# EAGLE design rgb-secamfm500 (EAGLE 6.4)
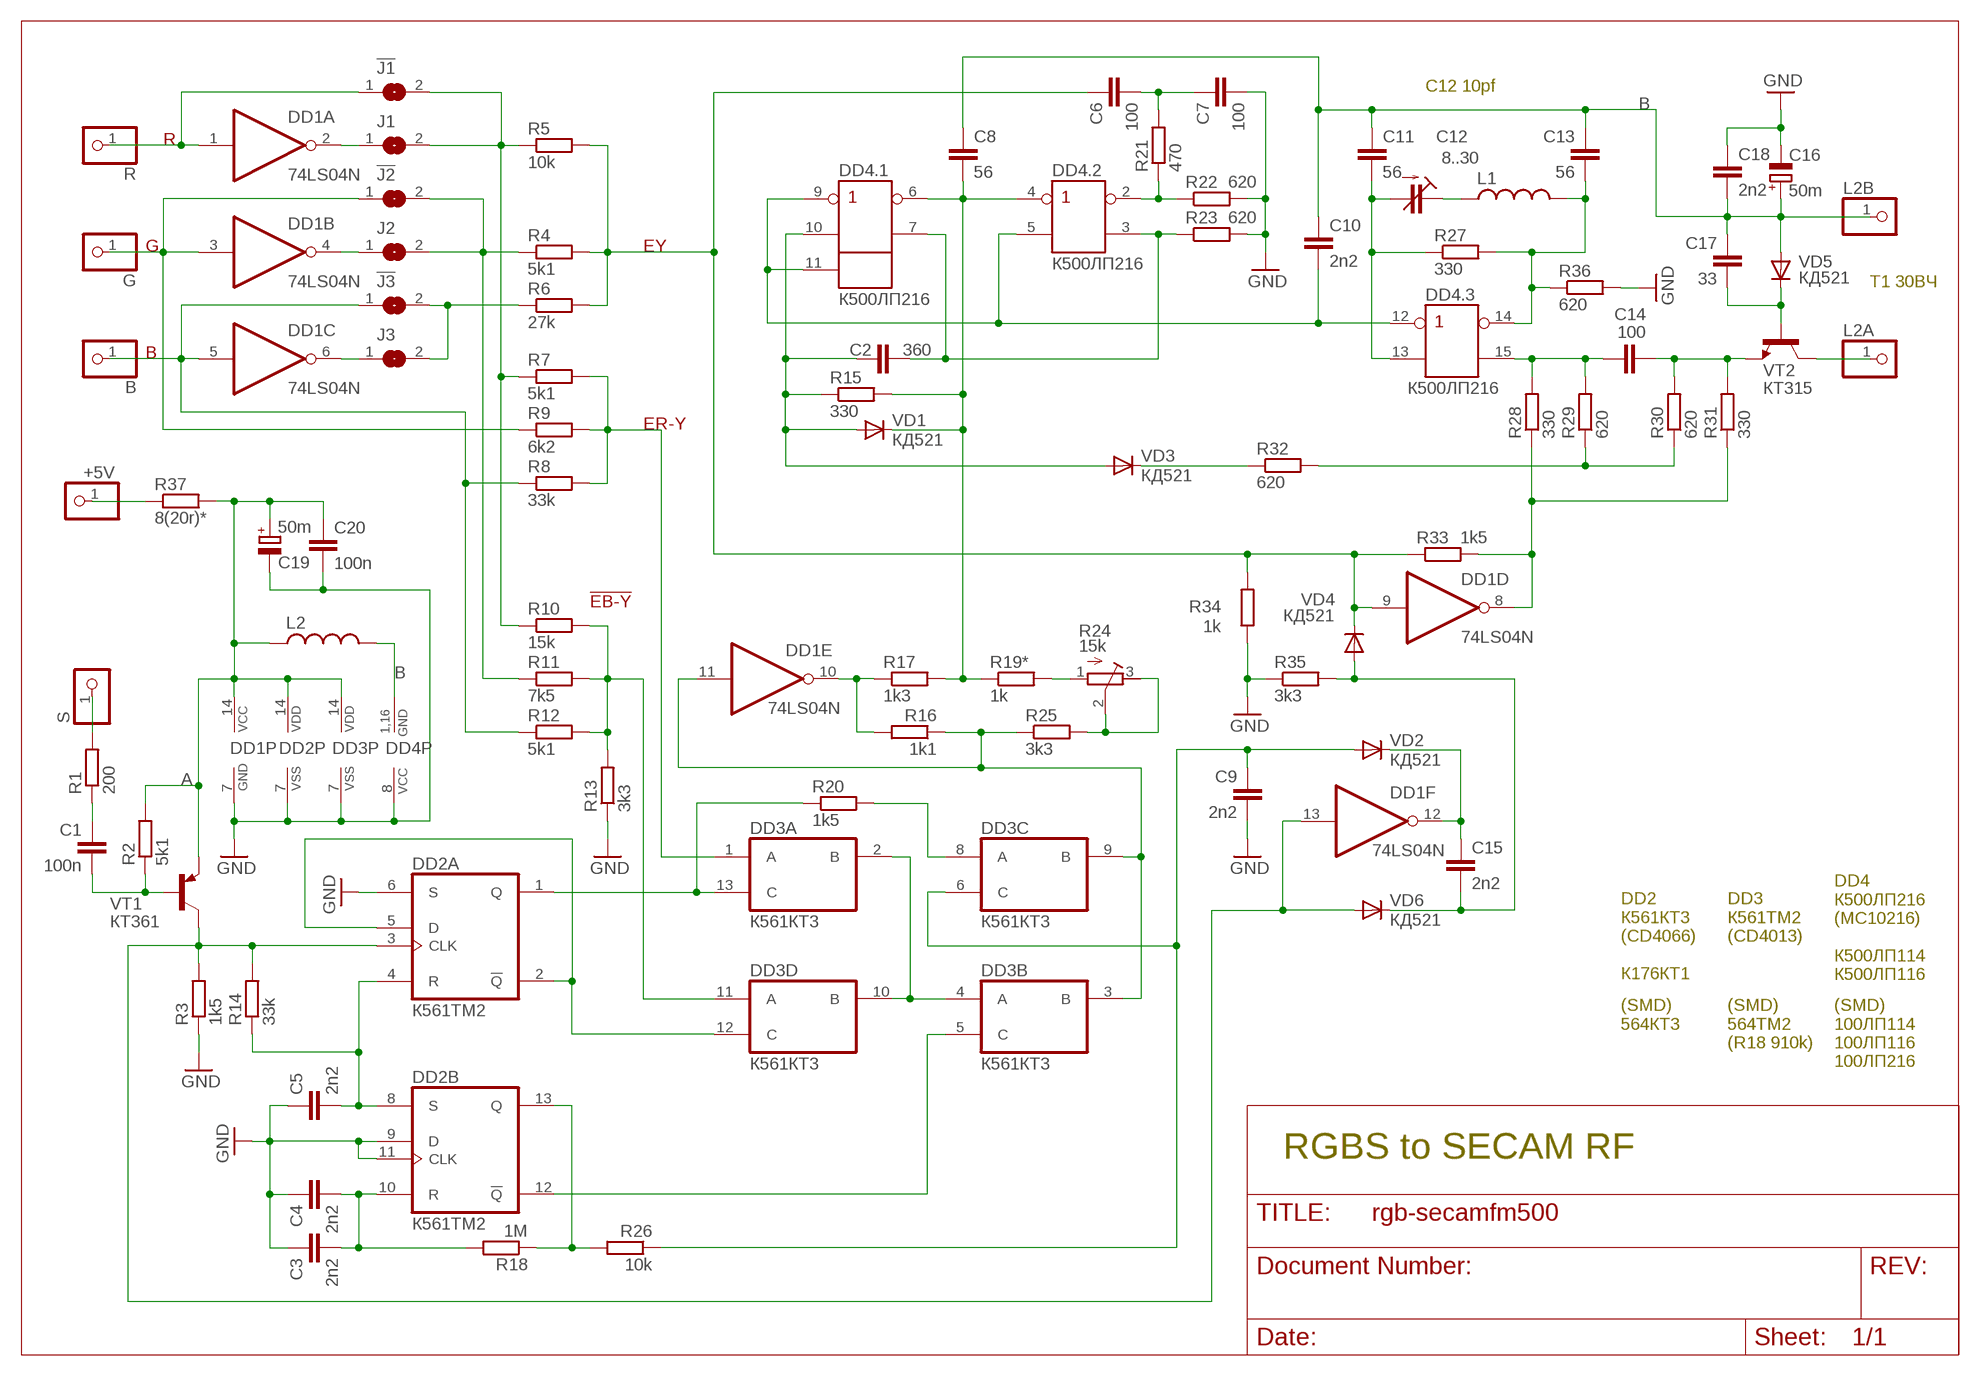
[diagram p0: schematic, sheet 1]

## Parts
!J1  SJ  [SJ]
!J2  SJ  [SJ]
!J3  SJ  [SJ]
+5V  PINHD-1X1  [1X01]
B  PINHD-1X1  [1X01]
C1  100n  C-EU025-025X050  [C025-025X050]
C2  360  C-EUC0805K  [C0805K]
C3  2n2  C-EUC0805  [C0805]
C4  2n2  C-EUC0805  [C0805]
C5  2n2  C-EUC0805K  [C0805K]
C6  100  C-EUC0805K  [C0805K]
C7  100  C-EUC0805K  [C0805K]
C8  56  C-EUC0805K  [C0805K]
C9  2n2  C-EUC0805K  [C0805K]
C10  2n2  C-EUC0805K  [C0805K]
C11  56  C-EUC0805K  [C0805K]
C12  8..30  C-TRIMM808-1  [CTRIM808-1]
C13  56  C-EUC0805K  [C0805K]
C14  100  C-EUC0805K  [C0805K]
C15  2n2  C-EUC0805K  [C0805K]
C16  50m  CPOL-EUE2.5-6  [E2,5-6]
C17  33  C-EUC0805K  [C0805K]
C18  2n2  C-EUC0805K  [C0805K]
C19  50m  CPOL-EUE2.5-6  [E2,5-6]
C20  100n  C-EUC0805K  [C0805K]
DD1  74LS04N  [DIL14]
DD2  К561ТМ2  4013N  [DIL14]
DD3  К561КТ3  4066N  [DIL14]
DD4  К500ЛП216  К500ЛП216R  [DIL16B]
G  PINHD-1X1  [1X01]
J1  SJ  [SJ]
J2  SJ  [SJ]
J3  SJ  [SJ]
L1  L1  [L1]
L2  L-US0204/5  [0204/5]
L2A  PINHD-1X1  [1X01]
L2B  PINHD-1X1  [1X01]
R  PINHD-1X1  [1X01]
R1  200  R-EU_M0805  [M0805]
R2  5k1  R-EU_M0805  [M0805]
R3  1k5  R-EU_M0805  [M0805]
R4  5k1  R-EU_M0805  [M0805]
R5  10k  R-EU_M0805  [M0805]
R6  27k  R-EU_M0805  [M0805]
R7  5k1  R-EU_M0805  [M0805]
R8  33k  R-EU_M0805  [M0805]
R9  6k2  R-EU_M0805  [M0805]
R10  15k  R-EU_M0805  [M0805]
R11  7k5  R-EU_M0805  [M0805]
R12  5k1  R-EU_M0805  [M0805]
R13  3k3  R-EU_M0805  [M0805]
R14  33k  R-EU_M0805  [M0805]
R15  330  R-EU_0207/12  [0207/12]
R16  1k1  R-EU_M0805  [M0805]
R17  1k3  R-EU_M0805  [M0805]
R18  1M  R-EU_M0805  [M0805]
R19*  1k  R-EU_M0805  [M0805]
R20  1k5  R-EU_0207/12  [0207/12]
R21  470  R-EU_M0805  [M0805]
R22  620  R-EU_M0805  [M0805]
R23  620  R-EU_M0805  [M0805]
R24  15k  R-TRIMM3296W  [RTRIM3296W]
R25  3k3  R-EU_M0805  [M0805]
R26  10k  R-EU_M0805  [M0805]
R27  330  R-EU_M0805  [M0805]
R28  330  R-EU_M0805  [M0805]
R29  620  R-EU_M0805  [M0805]
R30  620  R-EU_M0805  [M0805]
R31  330  R-EU_M0805  [M0805]
R32  620  R-EU_M0805  [M0805]
R33  1k5  R-EU_M0805  [M0805]
R34  1k  R-EU_M0805  [M0805]
R35  3k3  R-EU_M0805  [M0805]
R36  620  R-EU_M0805  [M0805]
R37  8(20r)*  R-EU_R1210  [R1210]
S  PINHD-1X1  [1X01]
VD1  КД521  DIODE-D-7.5  [D-7.5]
VD2  КД521  DIODE-D-7.5  [D-7.5]
VD3  КД521  DIODE-D-7.5  [D-7.5]
VD4  КД521  DIODE-D-7.5  [D-7.5]
VD5  КД521  DIODE-D-7.5  [D-7.5]
VD6  КД521  DIODE-D-7.5  [D-7.5]
VT1  КТ361  BJT_PNP_TO-92_ECB  [TO92]
VT2  КТ315  BJT_NPN_TO-92_ECB  [TO92]

## Nets
A: C19.+ C20.1 DD1.14(P:VCC) DD2.14(P:VDD) DD3.14(P:VDD) L2.1 R2.2 R37.2 VT1.1(E)
B: C8.1 C10.1 C11.1 C13.1 C16.+ C17.1 C18.2 DD4.1(P:GND) DD4.16(P:GND) L2.2 L2B.1 VD5.A
GND: C3.1 C4.1 C5.1 C7.2 C9.2 C16.- C18.1 C19.- C20.2 DD1.7(P:GND) DD2.6(A:S) DD2.7(P:VSS) DD2.9(B:D) DD2.11(B:CLK) DD3.7(P:VSS) DD4.8(P:VCC) R3.1 R13.1 R22.2 R23.2 R34.1 R35.1 R36.2
N$1: DD2.13(B:Q) R18.1 R26.2
N$2: R32.1 VD3.C
N$54: C6.1 DD1.9(D:I) R4.2 R5.2 R6.2 R33.1 R34.2 VD4.C
N$55: DD3.1(A:A) R7.2 R8.2 R9.2
N$56: DD3.11(D:A) R10.2 R11.2 R12.2 R13.2
N$57: !J1.1 DD1.1(A:I) R.1
N$58: !J1.2 J1.2 R5.1 R7.1 R10.1
N$59: !J2.2 J2.2 R4.1 R11.1
N$60: !J2.1 DD1.3(B:I) G.1 R9.1
N$61: DD1.6(C:O) J3.1
N$62: !J3.1 B.1 DD1.5(C:I) R8.1 R12.1
N$63: DD1.2(A:O) J1.1
N$64: DD3.2(A:B) DD3.4(B:A) DD3.10(D:B)
N$65: DD1.11(E:I) DD3.3(B:B) DD3.9(C:B) R16.1 R25.1
N$66: DD1.4(B:O) J2.1
N$67: !J3.2 J3.2 R6.1
N$68: DD2.2(A:!Q) DD2.5(A:D) DD3.12(D:C)
N$69: C5.2 DD2.4(A:R) DD2.8(B:S) R14.1
N$70: DD1.13(F:I) DD2.3(A:CLK) R3.2 R14.2 VD6.A VT1.2(C)
N$71: DD2.1(A:Q) DD3.13(A:C) R20.1
N$73: C1.2 R2.1 VT1.3(B)
N$74: R1.2 S.1
N$75: C1.1 R1.1
N$76: +5V.1 R37.1
N$77: C3.2 C4.2 DD2.10(B:R) R18.2
N$78: DD2.12(B:!Q) DD3.5(B:C)
N$79: DD1.10(E:O) R16.2 R17.1
N$80: C8.2 DD4.4(.2:!IN) DD4.6(.1:!OUT) R15.2 R17.2 R19*.1 VD1.C
N$81: C9.1 DD3.6(C:C) R26.1 VD2.A
N$82: DD3.8(C:A) R20.2
N$83: C15.1 DD1.12(F:O) VD2.C
N$84: R24.2(S) R24.3(E) R25.2
N$85: C10.2 DD4.5(.2:IN) DD4.9(.1:!IN) DD4.11(.1:V) DD4.12(.3:!IN)
N$86: C11.2 C12.2(A) DD4.13(.3:IN) R27.1
N$87: R19*.2 R24.1(A)
N$88: C2.2 DD4.3(.2:OUT) DD4.7(.1:OUT) R23.1
N$89: C2.1 DD4.10(.1:IN) R15.1 VD1.A VD3.A
N$90: DD4.2(.2:!OUT) R21.1 R22.1
N$91: C6.2 C7.1 R21.2
N$92: C13.2 DD4.14(.3:!OUT) L1.P$2 R27.2 R36.1
N$93: C12.1(E) L1.P$1
N$94: C17.2 VD5.C VT2.3(B)
N$95: C14.1 DD4.15(.3:OUT) R28.2 R29.2
N$96: C14.2 R30.2 R31.2 VT2.1(E)
N$97: R29.1 R30.1 R32.2
N$98: DD1.8(D:O) R28.1 R31.1 R33.2
N$100: L2A.1 VT2.2(C)
N$102: C15.2 R35.2 VD4.A VD6.C

## Notes on the sheet
- C12 10pf
- R
- G | EY
- T1 30ВЧ
- B
- ER-Y
- !EB-Y
- DD4 
  К500ЛП216
  (MC10216)
  
  К500ЛП114
  К500ЛП116
- DD2
  К561КТ3
  (CD4066)
  
  К176КТ1
- DD3
  К561ТМ2
  (CD4013)
- (SMD)
  564КТ3
- (SMD)
  564ТМ2
  (R18 910k)
- (SMD)
  100ЛП114
  100ЛП116
  100ЛП216
- RGBS to SECAM RF

## Library data of the parts
!J1-!J3 J1-J3 = jumper:SJ: SMD solder JUMPER
+5V B G L2A L2B R S = Разъёмы штырьковые 2.54мм:PINHD-1X1: PIN HEADER
C1-C11 C13-C15 C17 C18 C20 = rcl:C-EU: CAPACITOR, European symbol
C12 = Speccy:C-TRIMM: Trimm capacitor
C16 C19 = rcl:CPOL-EU: POLARIZED CAPACITOR, European symbol
DD1 = 74xx-eu:74*04: Hex INVERTER
DD2 = 40xx:4013: Dual D FLIP FLOP, set/reset
DD3 = 40xx:4066: Quad bilateral ANALOG SWITCH
DD4 = 500:К500ЛП
L1 = secam500lp:L1
L2 = rcl:L-US: INDUCTOR, American symbol
R1-R18 R19* R20-R23 R25-R37 = rcl:R-EU_: RESISTOR, European symbol
R24 = rcl:R-TRIMM: Trimm resistor
VD1-VD6 = diode:DIODE-: DIODE
VT1 = m_transistor:BJT_PNP: PNP Transistror КТ3107* CBE BD138 ECB BC847 SOT23 BCE
VT2 = m_transistor:BJT_NPN: NPN Transistor 13005 TO-220 BCE КТ805 TO-220 ECB КТ3102*М TO-92 CBE МП37 ТО-5 BC847 SOT23 BCE

## Board
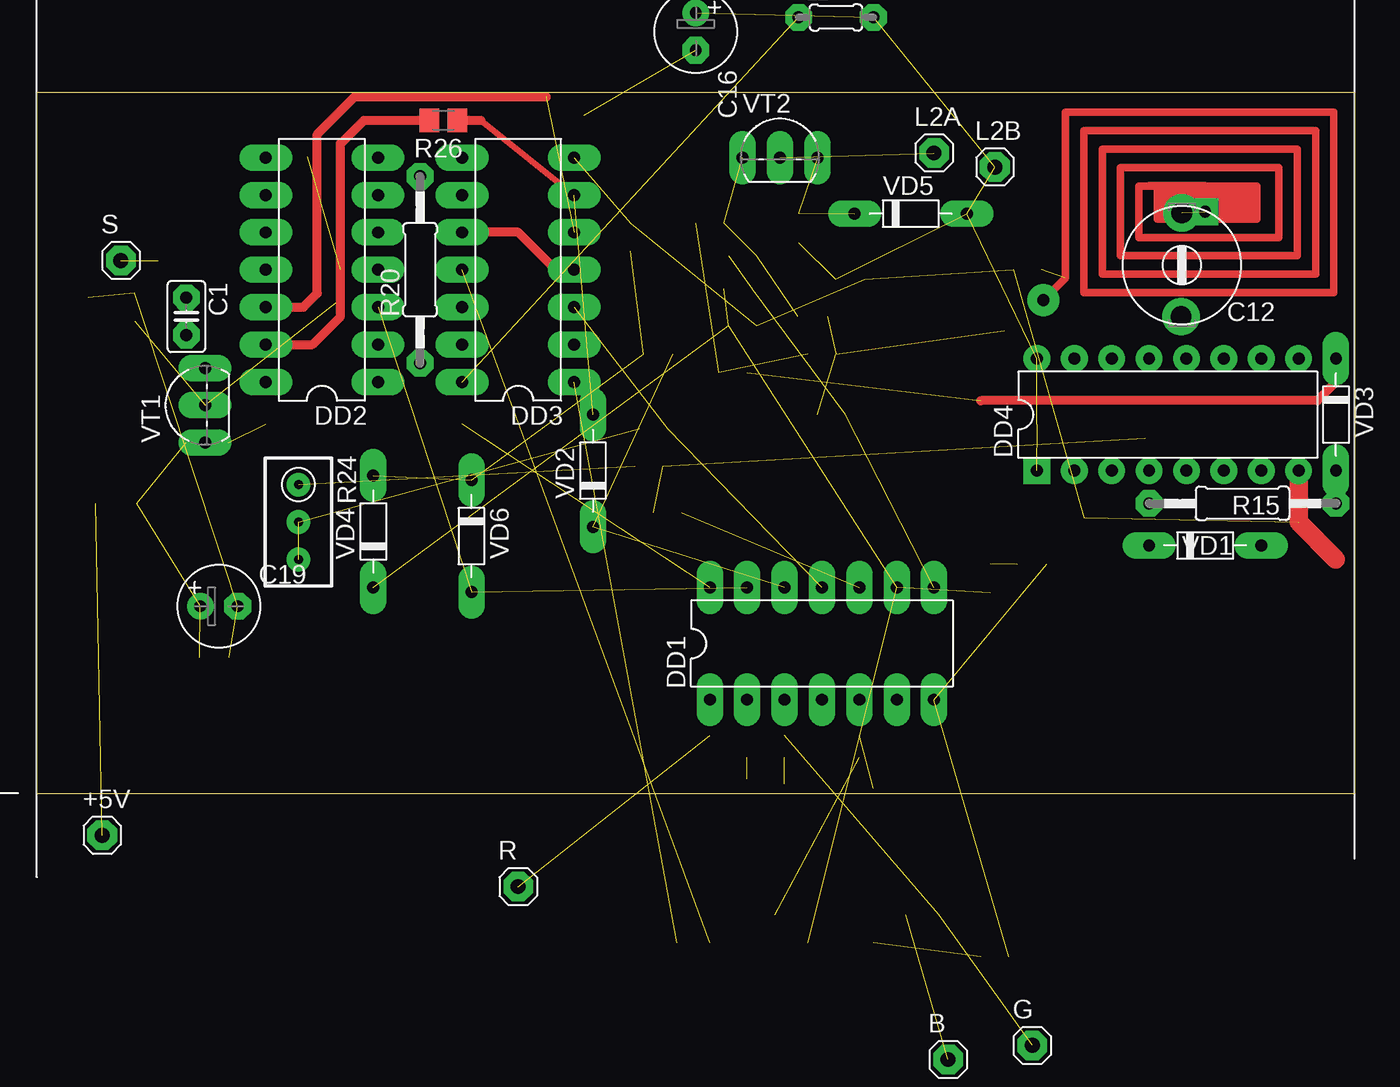
[diagram p1: board, top side]
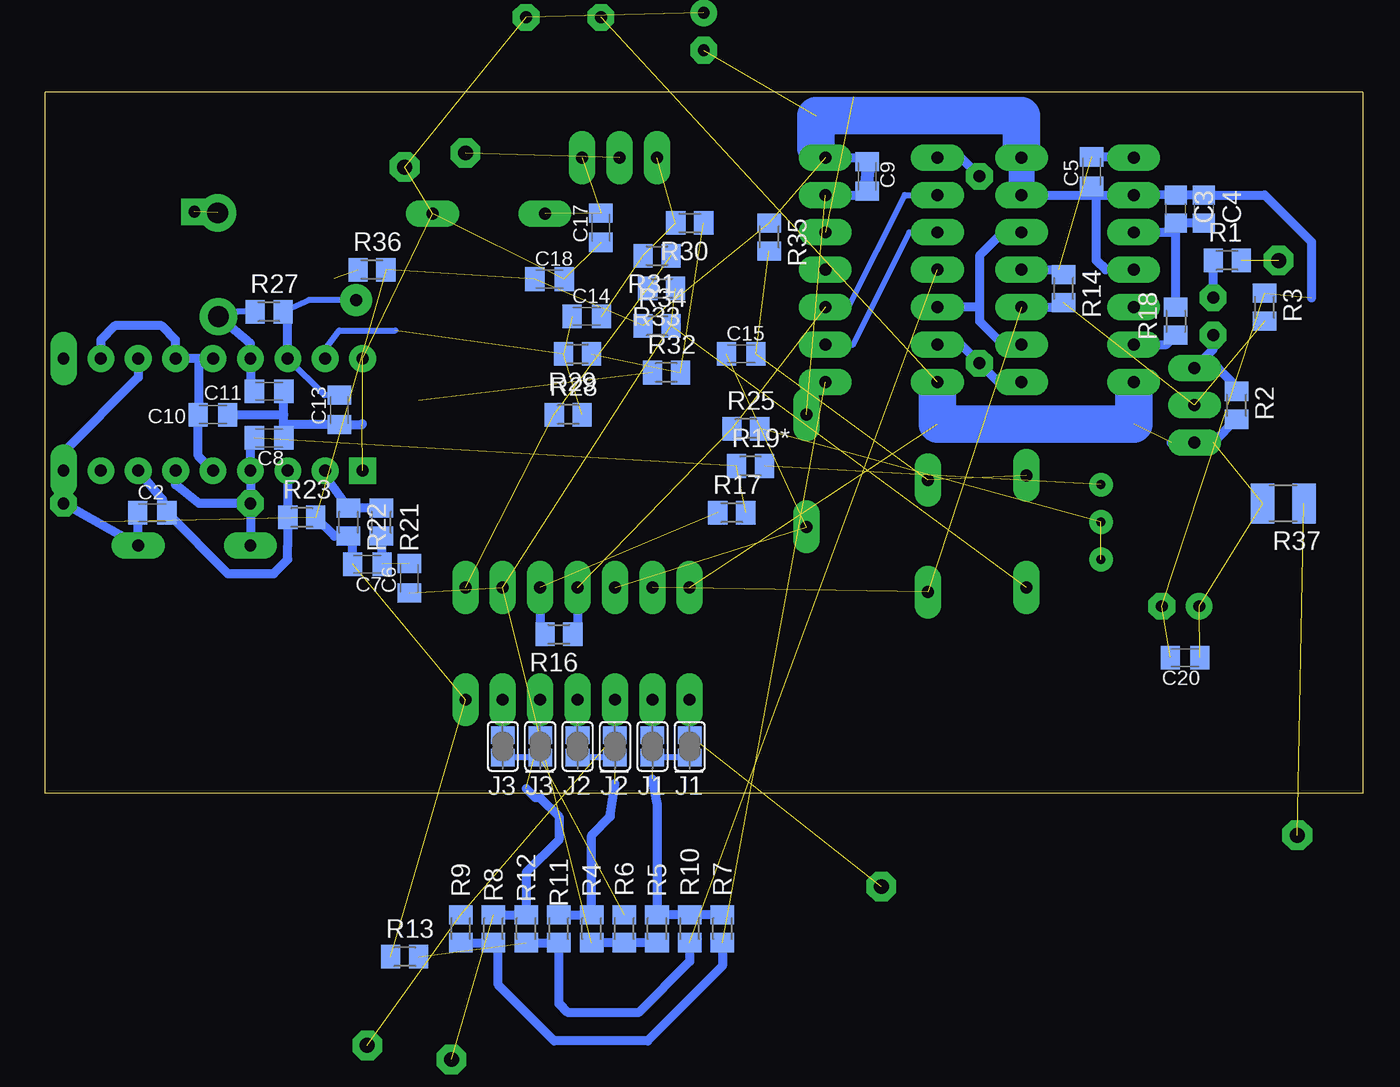
[diagram p2: board, bottom side, seen from below]

Size 89.54 x 47.63 mm. Coordinates in mm from the lower left corner, seen from the top.
Outline: 89.52,0 0,0 0,47.63 89.52,47.63
Outline: 89.54,47.63 89.54,0
Copper layers (1*16): Top 0.035mm / dielectric 1.5mm / Bottom 0.035mm
Design rules "DesignRules": minimum track width 8mil, minimum drill 24mil, track to track 0.2mm, track to pad 0.2mm, pad to pad 8mil, via to via 8mil, smd to smd 8mil, copper to edge 10mil, drill to drill 8mil, minimum pad ring 0.5mm, minimum via ring 8mil, stop-mask expansion 4mil, vias tented up to drill 0mil, thermal gap 10mil

### Footprints (pad centres in the part's own frame; a part is rotated, then mirrored left to right if it is on the bottom)
SJ = smd 1.168 x 1.6: 1 -0.762,0; 2 0.762,0
1X01 = drill 1.016 octagon: 1 0,0
C025-025X050 = drill 0.813 octagon: 1 -1.27,0; 2 1.27,0
C0805K = smd 1.3 x 1.6: 1 -1,0; 2 1,0
C0805 = smd 1.3 x 1.5: 1 -0.95,0; 2 0.95,0
CTRIM808-1 = drill 1.4 pad 2.54: 1 -3.556,0; 2 3.5,-0.056
E2,5-6 = drill 0.813 pad 1.6: + -1.27,0 | drill 0.813 pad 1.6 octagon: - 1.27,0
DIL14 = drill 0.813 long: 1 -7.62,-3.81; 2 -5.08,-3.81; 3 -2.54,-3.81; 4 0,-3.81; 5 2.54,-3.81; 6 5.08,-3.81; 7 7.62,-3.81; 8 7.62,3.81; 9 5.08,3.81; 10 2.54,3.81; 11 0,3.81; 12 -2.54,3.81; 13 -5.08,3.81; 14 -7.62,3.81
DIL16B = drill 0.813 square: 1 -8.89,-3.81 | drill 0.813: 2 -6.35,-3.81; 3 -3.81,-3.81; 4 -1.27,-3.81; 5 1.27,-3.81; 6 3.81,-3.81; 7 6.35,-3.81; 8 8.89,-3.81; 9 8.89,3.81; 10 6.35,3.81; 11 3.81,3.81; 12 1.27,3.81; 13 -1.27,3.81; 14 -3.81,3.81; 15 -6.35,3.81; 16 -8.89,3.81
L1 = drill 0.8 pad 1.422 square: P$1 0,-0.5 | drill 0.8 pad 2.184: P$2 -11,-6.5
0204/5 = drill 0.813 octagon: 1 -2.54,0; 2 2.54,0
M0805 = smd 1.3 x 1.6: 1 -0.95,0; 2 0.95,0
0207/12 = drill 0.813 octagon: 1 -6.35,0; 2 6.35,0
RTRIM3296W = drill 0.61: 1 0,-2.54; 2 0,0; 3 0,2.54
R1210 = smd 1.6 x 2.7: 1 -1.4,0; 2 1.4,0
D-7.5 = drill 0.813 long: A 3.81,0; C -3.81,0
TO92 = drill 0.813 long: 1 -2.54,-1.27; 2 0,-1.27; 3 2.54,-1.27

### Placement (x,y rotation side)
!J1  45.72,3.18 270 bottom
!J2  50.8,3.18 270 bottom
!J3  55.88,3.18 270 bottom
+5V  4.44,-2.86 0 top
B  61.91,-18.1 0 top  (outside the outline)
C1  10.16,32.38 270 top
C2  82.23,19.05 0 bottom
C3  12.7,39.69 270 bottom
C4  10.79,39.69 270 bottom
C5  18.41,42.23 90 bottom
C6  64.77,14.6 90 bottom
C7  67.63,15.56 180 bottom
C8  74.3,24.13 180 bottom
C9  33.66,41.91 270 bottom
C10  78.11,25.72 180 bottom
C11  74.3,27.3 180 bottom
C12  77.79,35.88 270 top
C13  69.53,26.04 90 bottom
C14  52.7,32.38 0 bottom
C15  42.23,29.84 0 bottom
C16  44.77,51.75 270 top
C17  51.75,38.42 90 bottom
C18  55.24,34.92 0 bottom
C19  12.38,12.7 0 top
C20  12.06,9.21 180 bottom
DD1  53.34,10.16 0 top
DD2  19.37,35.56 90 top
DD3  32.7,35.56 90 top
DD4  76.84,25.72 0 top
G  67.63,-17.14 0 top  (outside the outline)
J1  48.26,3.18 270 bottom
J2  53.34,3.18 270 bottom
J3  58.42,3.18 270 bottom
L1  79.38,40.01 0 top
L2  54.29,52.71 0 top  (outside the outline)
L2A  60.96,43.5 0 top
L2B  65.09,42.54 0 top
R  32.7,-6.35 0 top  (outside the outline)
R1  9.21,36.2 0 bottom
R2  8.57,26.35 270 bottom
R3  6.67,33.02 270 bottom
R4  52.39,-9.21 270 bottom  (outside the outline)
R5  47.94,-9.21 270 bottom  (outside the outline)
R6  50.16,-9.21 270 bottom  (outside the outline)
R7  43.5,-9.21 270 bottom  (outside the outline)
R8  59.05,-9.21 270 bottom  (outside the outline)
R9  61.28,-9.21 270 bottom  (outside the outline)
R10  45.72,-9.21 270 bottom  (outside the outline)
R11  54.61,-9.21 270 bottom  (outside the outline)
R12  56.83,-9.21 270 bottom  (outside the outline)
R13  65.09,-11.11 0 bottom  (outside the outline)
R14  20.32,34.29 270 bottom
R15  81.92,19.69 180 top
R16  54.61,10.8 180 bottom
R17  42.86,19.05 0 bottom
R18  12.7,32.07 90 bottom
R19*  41.59,22.23 0 bottom
R20  26.03,35.56 90 top
R21  66.68,18.41 270 bottom
R22  68.9,18.41 270 bottom
R23  72.07,18.73 0 bottom
R24  17.78,18.41 180 top
R25  41.91,24.77 0 bottom
R26  27.62,45.72 180 top
R27  74.3,32.7 0 bottom
R28  53.98,25.72 0 bottom
R29  53.34,29.84 180 bottom
R30  45.72,38.74 180 bottom
R31  47.94,36.51 180 bottom
R32  47.31,28.58 0 bottom
R33  47.62,34.29 180 bottom
R34  47.94,31.75 0 bottom
R35  40.32,37.78 270 bottom
R36  67.31,35.56 0 bottom
R37  5.4,19.69 180 bottom
S  5.71,36.2 0 top
VD1  79.38,16.83 0 top
VD2  37.78,21.91 90 top
VD3  88.27,25.72 270 top
VD4  22.86,17.78 90 top
VD5  59.37,39.37 0 top
VD6  29.53,17.46 270 top
VT1  10.16,26.35 90 top
VT2  50.48,44.45 0 top

### Tracks (layer width: path | path; a pad name or v marks a point on that pad's centre or on a via)
A  (6 unrouted)
  Bottom 0.61: 13.02,23.81 VT1.1 10.16,23.81 R2.2
  Bottom 1.778: DD3.14 28.89,26.99 | 15.56,27.3 DD2.14
  Bottom 2.54: 28.89,26.99 28.89,25.08 15.56,25.08 15.56,27.3
B  (8 unrouted)
  Bottom 0.61: 67.95,25.08 67.99,25.04 C13.1 73.25,25.04 73.3,25.08 | C8.1 73.3,25.08 | 73.3,25.08 73.3,25.72 | 73.3,25.72 C11.1 | C10.1 73.3,25.72
GND  (12 unrouted)
  Top 1.27: DD4.8 85.73,18.41 88.27,15.88
  Bottom 0.61: DD2.11 17.46,35.56 18.1,36.2 18.1,40.64 | 18.1,40.64 DD2.9 15.51,40.69 C3.1 C4.1 6.67,40.64 3.49,37.46 3.49,33.66 | DD2.6 18.41,40.64 | 18.41,40.64 18.1,40.64 | C5.1 18.41,40.64 | R23.2 69.86,17.47 R22.2 68.63,17.2 C7.2 | DD3.7 33.38,43.18 C9.2
  Bottom 1.778: DD2.7 DD2.6 | DD3.7 37.15,43.82
  Bottom 2.54: DD2.7 23.18,46.04 37.15,46.04 37.15,43.82
N$1
  Top 0.61: DD2.13 18.73,30.48 20.64,32.38 20.64,44.13 22.23,45.72 R26.2
  Bottom 0.61: DD2.13 13.34,30.48 R18.1
N$2  (1 unrouted)
  Top 0.61: 64.14,26.67 87,26.67 88.27,27.94 VD3.C
N$54  (5 unrouted)
  Bottom 0.61: R4.2 R6.2 R5.2
N$55  (1 unrouted)
  Bottom 0.61: R9.2 R8.2 58.74,-10.48 58.74,-13.02 54.93,-16.83 48.58,-16.83 43.5,-11.75 R7.2
N$56  (2 unrouted)
  Bottom 0.61: R12.2 R11.2 54.61,-14.29 53.98,-14.92 49.21,-14.92 45.72,-11.43 R10.2
N$57  (1 unrouted)
  Bottom 0.406: DD1.1 !J1.1
N$58  (1 unrouted)
  Bottom 0.406: !J1.2 J1.2
  Bottom 0.61: 48.26,0.95 47.94,-0.63 R5.1 R10.1 R7.1
N$59  (1 unrouted)
  Bottom 0.406: !J2.2 J2.2
  Bottom 0.61: R11.1 R4.1 52.39,-2.86 51.12,-1.59 50.8,0.64
N$60  (2 unrouted)
  Bottom 0.406: !J2.1 DD1.3
N$61
  Bottom 0.406: J3.1 DD1.6
N$62  (2 unrouted)
  Bottom 0.406: !J3.1 DD1.5
  Bottom 0.61: R8.1 R12.1 56.83,-5.4 54.61,-3.18 54.61,-1.59 55.88,-0.32 56.2,-0.32 56.83,0.32
N$63
  Bottom 0.406: DD1.2 J1.1
N$64
  Top 0.61: DD3.4 35.24,35.56 32.7,38.1 DD3.10
  Bottom 0.406: DD3.2 34.61,30.48 30.8,38.1 DD3.10
N$65  (2 unrouted)
  Bottom 0.406: DD3.3 34.92,33.02 31.11,40.64 DD3.9
  Bottom 0.61: DD1.11 53.34,11.12 R16.1
N$66
  Bottom 0.406: J2.1 DD1.4
N$67  (1 unrouted)
  Bottom 0.406: !J3.2 J3.2
N$68
  Bottom 0.61: DD2.2 24.45,30.48 26.03,32.07 26.03,33.02 | 26.03,33.02 DD3.12 | DD2.5 24.45,38.1 26.03,36.51 26.03,33.02
N$69  (1 unrouted)
  Bottom 0.61: C5.2 15.6,43.23 DD2.8 | DD2.4 20.64,35.56 R14.1
N$70  (4 unrouted)
  Bottom 0.61: DD2.3 20.64,33.02 R14.2
N$71
  Bottom 0.61: DD3.13 27.3,30.48 R20.1 24.77,27.94 DD2.1
N$73
  Bottom 0.61: C1.2 10.16,30.16 VT1.3 9.84,28.89 8.57,27.62 R2.1
N$74  (1 unrouted)
N$75
  Bottom 0.61: C1.1 R1.1
N$76  (1 unrouted)
N$77
  Bottom 0.61: C4.2 C3.2 12.7,38.1 | R18.2 12.7,38.1 | DD2.10 12.7,38.1
N$78  (1 unrouted)
  Top 0.61: DD2.12 18.1,33.02 19.05,33.97 19.05,44.77 21.59,47.31 34.61,47.31
N$79  (1 unrouted)
  Bottom 0.61: DD1.10 55.88,11.12 R16.2
N$80  (2 unrouted)
  Bottom 0.61: R15.2 DD4.4 75.57,23.86 C8.2 | R15.2 VD1.C | R15.2 79.06,19.69 80.65,20.95 DD4.6
N$81  (1 unrouted)
  Top 0.406: 30.16,45.72 DD3.6
  Top 0.61: R26.1 30.16,45.72
  Bottom 0.61: DD3.6 33.92,40.64 C9.1
N$82
  Bottom 0.61: R20.2 27.3,43.18 DD3.8
N$83  (2 unrouted)
N$84  (2 unrouted)
N$85
  Bottom 0.61: DD4.12 79.06,29.53 | 79.06,29.53 DD4.11 80.65,30.8 81.6,31.75 84.77,31.75 85.73,30.8 DD4.9 | DD4.5 79.11,22.91 C10.2 79.06,25.45 79.06,29.53
N$86
  Bottom 0.406: R27.1 76.45,32.7 C12.2
  Bottom 0.61: C11.2 75.57,27.89 DD4.13 75.57,30.53 C12.2
N$87  (1 unrouted)
N$88
  Bottom 0.61: DD4.3 R23.1 73.02,16.83 73.03,16.83 73.03,15.88 73.98,14.92 77.11,14.92 C2.2 81.55,19.95 DD4.7
N$89
  Bottom 0.61: DD4.10 83.19,28.26 88.27,23.18 VD3.A R15.1 VD1.A 83.23,16.88 C2.1
N$90
  Bottom 0.61: DD4.2 70.48,21.59 R22.1 R21.1
N$91  (1 unrouted)
  Bottom 0.61: C7.1 66.63,17.42 R21.2
N$92  (1 unrouted)
  Bottom 0.406: L1.P$2 71.59,33.51 R27.2 | C13.2 70.53,27.04 DD4.14
  Bottom 0.61: DD4.14 73.03,32.38 R27.2
N$93  (1 unrouted)
N$94  (2 unrouted)
N$95  (3 unrouted)
  Bottom 0.406: DD4.15 70.48,30.16 69.53,31.43 65.72,31.43
N$96  (3 unrouted)
N$97  (2 unrouted)
N$98  (3 unrouted)
N$100  (1 unrouted)
N$102  (3 unrouted)